# EAGLE design PR9023 (EAGLE 7.5.0)
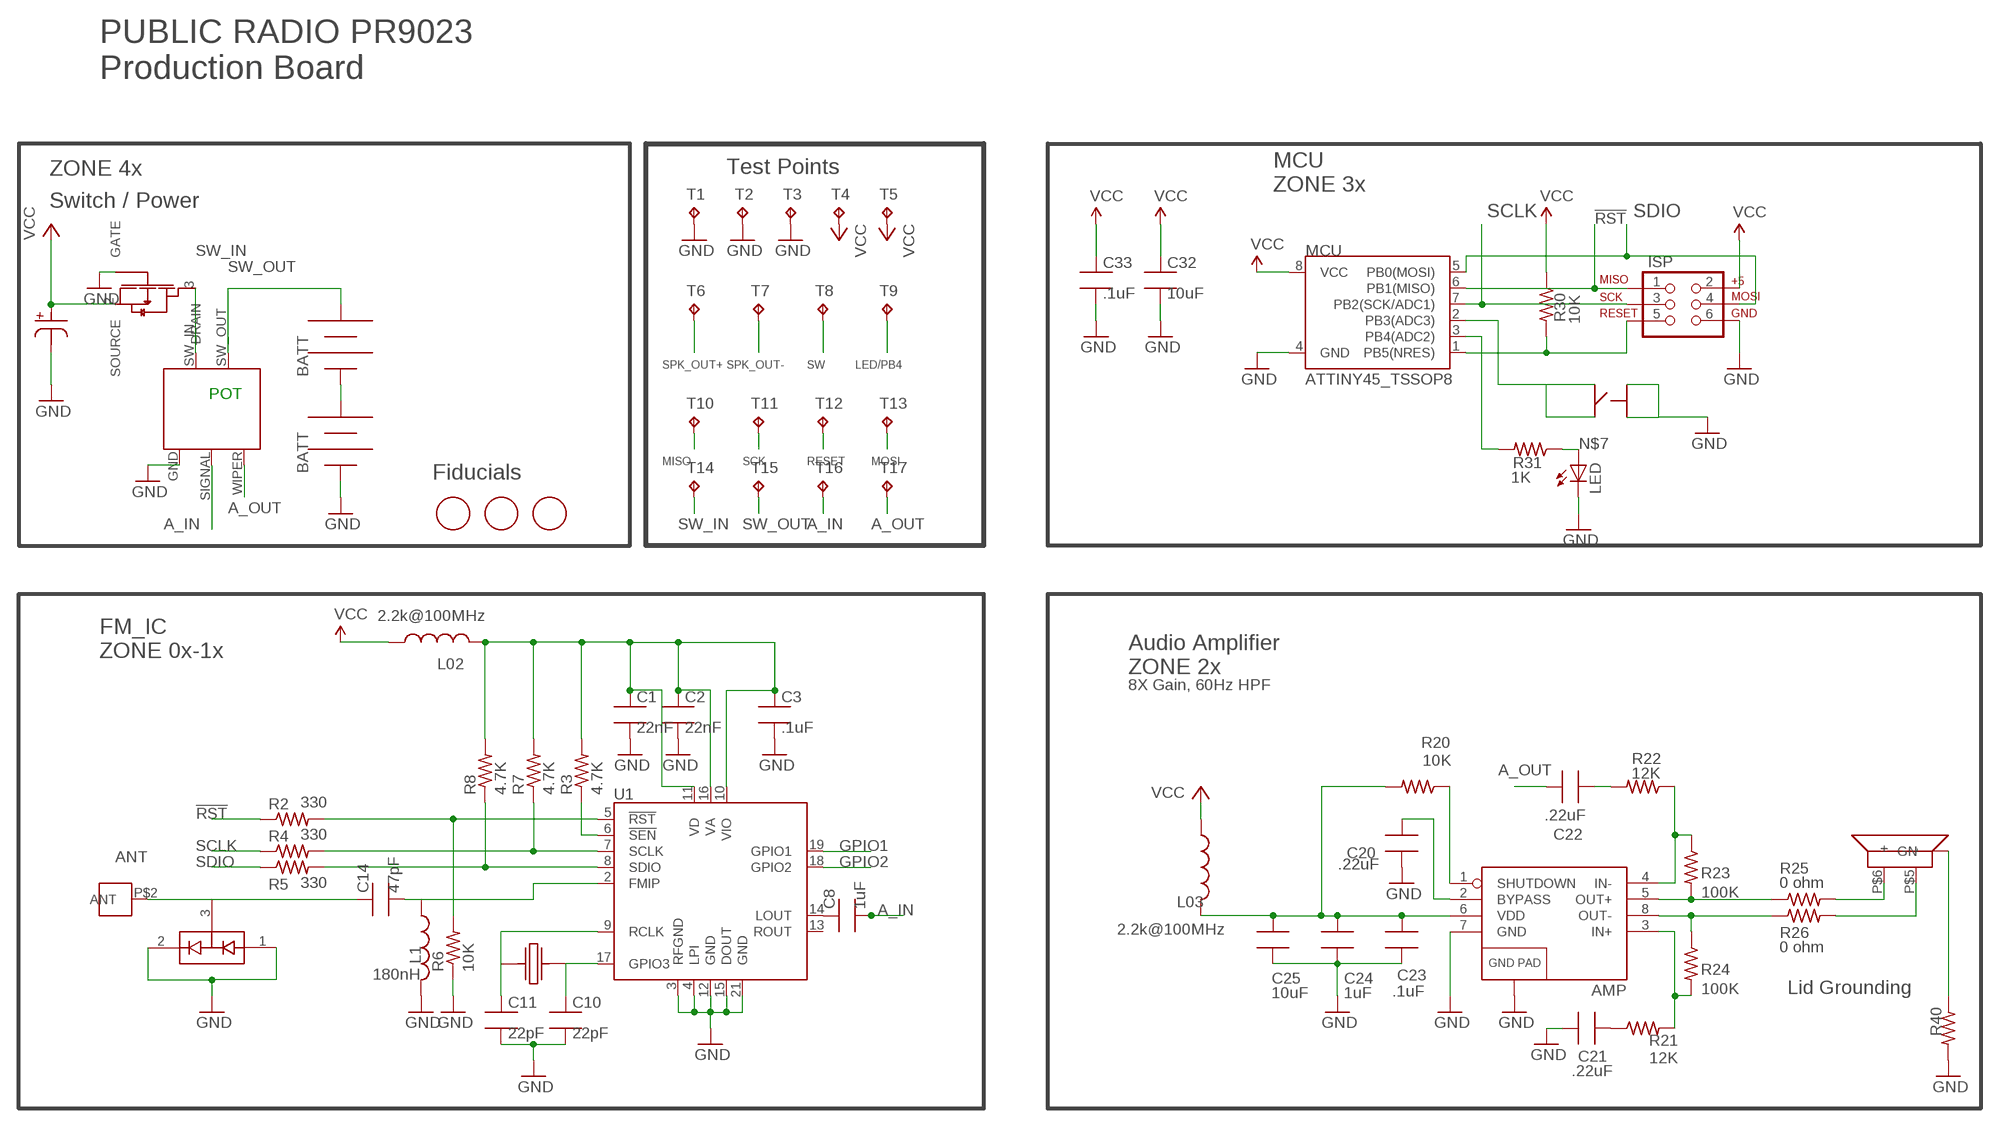
[diagram p0: schematic, sheet 1]

## Parts
AMP  TPA6203A1  [8-MSOP]
ANT_MOUNT  DNP  M3_PEMNUT  [PEM_M3]
C1  22nF  C_SMT_0603_CPL  [0603_CPL]
C2  22nF  C_SMT_0603_CPL  [0603_CPL]
C3  .1uF  C_SMT_0603_CPL  [0603_CPL]
C8  1uF  C_SMT_0603_CPL  [0603_CPL]
C10  22pF  C_SMT_0603_CPL  [0603_CPL]
C11  22pF  C_SMT_0603_CPL  [0603_CPL]
C14  47pF  C_SMT_0603_CPL  [0603_CPL]
C20  .22uF  C_SMT_0603_CPL  [0603_CPL]
C21  .22uF  C_SMT_0603_CPL  [0603_CPL]
C22  .22uF  C_SMT_0603_CPL  [0603_CPL]
C23  .1uF  C_SMT_0603_CPL  [0603_CPL]
C24  1uF  C_SMT_0603_CPL  [0603_CPL]
C25  10uF  C_SMT_0603_CPL  [0603_CPL]
C32  10uF  C_SMT_0603_CPL  [0603_CPL]
C33  .1uF  C_SMT_0603_CPL  [0603_CPL]
C40  220uF  NICHICON_SERIESUD  [NICHICON_UD_63]
D1  BAV99  [SOT23_CPL]
FET1  AO3435  [SOT23_CPL]
ISP  AVR_SPI_PRG_6NS  [2X3-NS]
JP5  BK-92_MPD_AA_BATT_CLIP  [BK92_AA_BATT]
JP6  BK-92_MPD_AA_BATT_CLIP  [BK92_AA_BATT]
L1  180nH  L_SMT_0805_ADAFRUIT  [0805_ADAFRUIT]
L02  2.2k@100MHz  L_SMT_0603_CPL  [0603_CPL]
L03  2.2k@100MHz  L_SMT_0603_CPL  [0603_CPL]
LED  LEDCHIPLED_0805  [CHIPLED_0805]
MARK1  FIDUCIAL  [FIDUCIAL_1MM]
MARK2  FIDUCIAL  [FIDUCIAL_1MM]
MARK3  FIDUCIAL  [FIDUCIAL_1MM]
MCU  ATTINY45_TSSOP8  [TSSOP-8]
R1  RV170SF_TAIWANA_POT_SW  [RV170SF_SW_POT]
R2  330  R_SMT_R0603_CPL  [0603_CPL]
R3  4.7K  R_SMT_R0603_CPL  [0603_CPL]
R4  330  R_SMT_R0603_CPL  [0603_CPL]
R5  330  R_SMT_R0603_CPL  [0603_CPL]
R6  10K  R_SMT_R0603_CPL  [0603_CPL]
R7  4.7K  R_SMT_R0603_CPL  [0603_CPL]
R8  4.7K  R_SMT_R0603_CPL  [0603_CPL]
R20  10K  R_SMT_R0603_CPL  [0603_CPL]
R21  12K  R_SMT_R0603_CPL  [0603_CPL]
R22  12K  R_SMT_R0603_CPL  [0603_CPL]
R23  100K  R_SMT_R0603_CPL  [0603_CPL]
R24  100K  R_SMT_R0603_CPL  [0603_CPL]
R25  0 ohm  R_SMT_0805_ADAFRUIT  [0805_ADAFRUIT]
R26  0 ohm  R_SMT_0805_ADAFRUIT  [0805_ADAFRUIT]
R30  10K  R_SMT_R0603_CPL  [0603_CPL]
R31  1K  R_SMT_R0603_CPL  [0603_CPL]
R40  DNP  R_SMT_R0603_CPL  [0603_CPL]
SPKR_PLACE  DNP  PR9024_SPKR  [PR2024_SPKR_PLACE]
SW1  ESWT_TL3315  [E_SWITCH_TL3315]
T1  TPTP20R  [TP20R]
T2  TPTP20R  [TP20R]
T3  TPTP20R  [TP20R]
T4  TPTP20R  [TP20R]
T5  TPTP20R  [TP20R]
T6  TPTP20R  [TP20R]
T7  TPTP20R  [TP20R]
T8  TPTP20R  [TP20R]
T9  TPTP20R  [TP20R]
T10  TPTP20R  [TP20R]
T11  TPTP20R  [TP20R]
T12  TPTP20R  [TP20R]
T13  TPTP20R  [TP20R]
T14  TPTP20R  [TP20R]
T15  TPTP20R  [TP20R]
T16  TPTP20R  [TP20R]
T17  TPTP20R  [TP20R]
U1  SI4702-C19-GMR  [SI470X_20_QFN]
X1  ABS25XTAL  [4-SOJ]

## Nets
3.3V: C1.1 C2.1 C3.1 L02.2 R3.2 R7.2 R8.2 U1.10(VIO) U1.11(VD) U1.16(VA)
!RST: ISP.1 MCU.6(PB1(MISO)) R2.1 T10.TP
!RST-L: R2.2 R6.2 U1.5(!RST)
!SEN-L: R3.1 U1.6(!SEN)
A_IN: C8.2 R1.SIGNAL T16.TP
A_OUT: C22.2 R1.WIPER T17.TP
ANT [antenna]: ANT_MOUNT.P$2(ANT) C14.1 D1.3(COM)
GND: AMP.7(GND) AMP.9(GND) C1.2 C2.2 C3.2 C10.2 C11.2 C20.1 C21.1 C23.2 C24.2 C25.2 C32.2 C33.2 C40.P$2 D1.1(A1) D1.2(C2) FET1.1(GATE) ISP.6 JP6.NEG JP6.NEG@2(NEG) L1.2 LED.C MCU.4(GND) R1.GND R6.1 R40.2 SW1.P$1 SW1.P$2 T1.TP T2.TP T3.TP U1.3(RFGND) U1.4(LPI) U1.12(GND) U1.15(DOUT) U1.21(GND)
GPIO1: U1.19(GPIO1)
GPIO2: U1.18(GPIO2)
LED/PB4: MCU.3(PB4(ADC2)) R31.2 T9.TP
N$1: C11.1 U1.9(RCLK) X1.P$1
N$2: AMP.6(VDD) C23.1 C24.1 C25.1 L03.2 R20.2
N$3: C22.1 R22.2
N$4: AMP.5(OUT+) R23.2 R25.1
N$5: AMP.3(IN+) R21.2 R24.2
N$6: R40.1 SPKR_PLACE.P$4(GN)
N$7: LED.A R31.1
N$9: C8.1 U1.14(LOUT)
N$10: C10.1 U1.17(GPIO3) X1.P$4
N$11: AMP.8(OUT-) R24.1 R26.1
N$12: AMP.2(BYPASS) C20.2
N$13: JP5.NEG JP5.NEG@2(NEG) JP6.POS JP6.POS@2(POS)
N$14: AMP.4(IN-) R22.1 R23.1
N$16 [antenna]: C14.2 L1.1 U1.2(FMIP)
N$20: AMP.1(SHUTDOWN) R20.1
N$23: C21.2 R21.1
RESET: ISP.5 MCU.1(PB5(NRES)) R30.2 T12.TP
SCLK: ISP.3 MCU.7(PB2(SCK/ADC1)) R4.1 T11.TP
SCLK-L: R4.2 R7.1 U1.7(SCLK)
SDIO: ISP.4 MCU.5(PB0(MOSI)) R5.1 T13.TP
SDIO-L: R5.2 R8.1 U1.8(SDIO)
SPK_OUT+: R25.2 SPKR_PLACE.P$6(+) T6.TP
SPK_OUT-: R26.2 SPKR_PLACE.P$5(-) T7.TP
SW: MCU.2(PB3(ADC3)) SW1.P$3 SW1.P$4 T8.TP
SW_IN: FET1.3(DRAIN) R1.SW_IN T14.TP
SW_OUT: JP5.POS JP5.POS@2(POS) R1.SW_OUT T15.TP
VCC: C32.1 C33.1 C40.P$1 FET1.2(SOURCE) ISP.2 L02.1 L03.1 MCU.8(VCC) R30.1 T4.TP T5.TP
Unconnected: U1.13(ROUT)

## Notes on the sheet
- PUBLIC RADIO PR9023
  Production Board
- ZONE 4x | Test Points
- MCU
  ZONE 3x
- Switch / Power
- POT
- MISO | SCK | RESET | MOSI
- Fiducials
- FM_IC
  ZONE 0x-1x
- Audio Amplifier 
  ZONE 2x
- 8X Gain, 60Hz HPF
- Lid Grounding

## Library data of the parts
AMP = PR_Parts_Library:TPA6203A1: IC AMP AUDIO PWR 1.25W AB 8MSOP; MFG_PN: TPA6203A1DGNR
ANT_MOUNT = PR_Parts_Library:M3_PEMNUT
C1 C2 = PR_Parts_Library:C_SMT: SMT capacitor; MFG_PN: CL10B223KB8NNNC; TOL: 10%; VOLTAGE: 16V
C3 C23 C33 = PR_Parts_Library:C_SMT: SMT capacitor; MFG_PN: CL10B104KB8SFNC; TOL: 10%; VOLTAGE: 16V
C8 C24 = PR_Parts_Library:C_SMT: SMT capacitor; MFG_PN: CL10B105KP8NNNC; TOL: 10%; VOLTAGE: 10V
C10 C11 = PR_Parts_Library:C_SMT: SMT capacitor; MFG_PN: C1608C0G1H220J080AA; TOL: 5%; VOLTAGE: 50V
C14 = PR_Parts_Library:C_SMT: SMT capacitor; MFG_PN: CL10C470JB8NCNC; TOL: 5%; VOLTAGE: 50V
C20-C22 = PR_Parts_Library:C_SMT: SMT capacitor; MFG_PN: C1608X7R1C224K080AC; TOL: 10%; VOLTAGE: 16V
C25 C32 = PR_Parts_Library:C_SMT: SMT capacitor; MFG_PN: CL10A106MQ8NNNC; TOL: 20%; VOLTAGE: 6.3V
C40 = PR_Parts_Library:NICHICON_SERIESUD: Nichicon UD Series 220uf Cap MFG# UUD1C221MCL1GS; MFG_PN: UUD1C221MCL1GS; TOL: 20%; VOLTAGE: 16V
D1 = PR_Parts_Library:BAV99: DIODE ARRAY GP 100V 215MA SOT23; MFG_PN: BAV99,215
FET1 = PR_Parts_Library:AO3435: MOSFET P-CH 20V 2.9A SOT23; MFG_PN: AO3435
ISP = PR_Parts_Library:AVR_SPI_PRG_6: DIL VERTICAL PC TAIL PIN HEADER; MFG_PN: M20-9980346
JP5 JP6 = PR_Parts_Library:BK-92_MPD_AA_BATT_CLIP: Thru hole AA battery clip pair.; MFG_PN: 2 of BK92 - supplied by CL Labs
L1 = PR_Parts_Library:L_SMT: SMT inductor; CURRENT: 400mA; DCR: 640m; MFG_PN: AISC-0805-R18J-T; TOL: 5%
L02 L03 = PR_Parts_Library:L_SMT: SMT inductor; CURRENT: 150mA; DCR: 2.3; MFG_PN: HZ0603A222R-10
LED = adafruit:LED: LED OSRAM: - CHIPLED LG R971, LG N971, LY N971, LG Q971, LY Q971, LO R971, LY R971 LH N974, LH R974 LS Q976, LO Q976, LY Q976 LO Q996 - Hyper CHIPLED LW Q18S LB Q993, LB Q99A, LB R99A - SideLED LS A670, LO A670, LY A670, LG A670, LP A670 LB A673, LV A673, LT A673, LW A673 LH A674 LY A675 LS A676, LA A676, LO A676, LY A676, LW A676 LS A679, LY A679, LG A679 - Hyper Micro SIDELED® LS Y876, LA Y876, LO Y876, LY Y876 LT Y87S - SmartLED LW L88C, LW L88S LB L89C, LB L89S, LG L890 LS L89K, LO L89K, LY L89K LS L896, LA L896, LO L896, LY L896 - TOPLED LS T670, LO T670, LY T670, LG T670, LP T670 LSG T670, LSP T670, LSY T670, LOP T670, LYG T670 LG T671, LOG T671, LSG T671 LB T673, LV T673, LT T673, LW T673 LH T674 LS T676, LA T676, LO T676, LY T676, LB T676, LH T676, LSB T676, LW T676 LB T67C, LV T67C, LT T67C, LS T67K, LO T67K, LY T67K, LW E67C LS E67B, LA E67B, LO E67B, LY E67B, LB E67C, LV E67C, LT E67C LW T67C LS T679, LY T679, LG T679 LS T770, LO T770, LY T770, LG T770, LP T770 LB T773, LV T773, LT T773, LW T773 LH T774 LS E675, LA E675, LY E675, LS T675 LS T776, LA T776, LO T776, LY T776, LB T776 LHGB T686 LT T68C, LB T68C - Hyper Mini TOPLED® LB M676 - Mini TOPLED Santana® LG M470 LS M47K, LO M47K, LY M47K Source: http://www.osram.convergy.de/; MFG_PN: LY R976-PS-36
MARK1-MARK3 = PR_Parts_Library:FIDUCIAL: 1mm fiducial.; MFG_PN: DNP
MCU = PR_Parts_Library:ATTINY45_TSSOP8
R1 = PR_Parts_Library:RV170SF_TAIWANA_POT_SW: Thru hole switched potentiometer.; MFG_PN: RV170SF-43-20F-A10K - supplied by CL Labs
R2 R4 R5 = PR_Parts_Library:R_SMT: SMT resistor; MFG_PN: MCR03ERTJ331; POWER: 1/10W; TOL: 5%
R3 R7 R8 = PR_Parts_Library:R_SMT: SMT resistor; MFG_PN: ERJ-3EKF4701V; POWER: 1/10W; TOL: 1%
R6 R20 R30 = PR_Parts_Library:R_SMT: SMT resistor; MFG_PN: ERJ-3GEYJ103V; POWER: 1/10W; TOL: 5%
R21 R22 = PR_Parts_Library:R_SMT: SMT resistor; MFG_PN: RC0603FR-0712KL; POWER: 1/10W; TOL: 1%
R23 R24 = PR_Parts_Library:R_SMT: SMT resistor; MFG_PN: ERJ-3EKF1003V; POWER: 1/10W; TOL: 1%
R25 R26 = PR_Parts_Library:R_SMT: SMT resistor; MFG_PN: ERJ-6GEY0R00V
R31 = PR_Parts_Library:R_SMT: SMT resistor; MFG_PN: ERJ-3EKF1001V; POWER: 1/10W; TOL: 1%
R40 = PR_Parts_Library:R_SMT: SMT resistor; MFG_PN: ERJ-3GEY0R00V
SPKR_PLACE = PR_Parts_Library:PR9024_SPKR
SW1 = PR_Parts_Library:ESWT_TL3315; MFG_PN: TL3315NF100Q
T1-T17 = PR_Parts_Library:TP: Test pad; MFG_PN: DNP
U1 = PR_Parts_Library:SI4702-C19-GMR: IC FM RADIO TUNER 20-QFN; MFG_PN: Si4702 C19 GM - supplied by CL Labs
X1 = PR_Parts_Library:ABS25XTAL: 4PIN 32.768 Xtal MFG# ABS25-32.768KHZ-T; MFG_PN: ABS25-32.768KHZ-T

## Net classes
1 antenna: clearance 1.27 mm

## Board
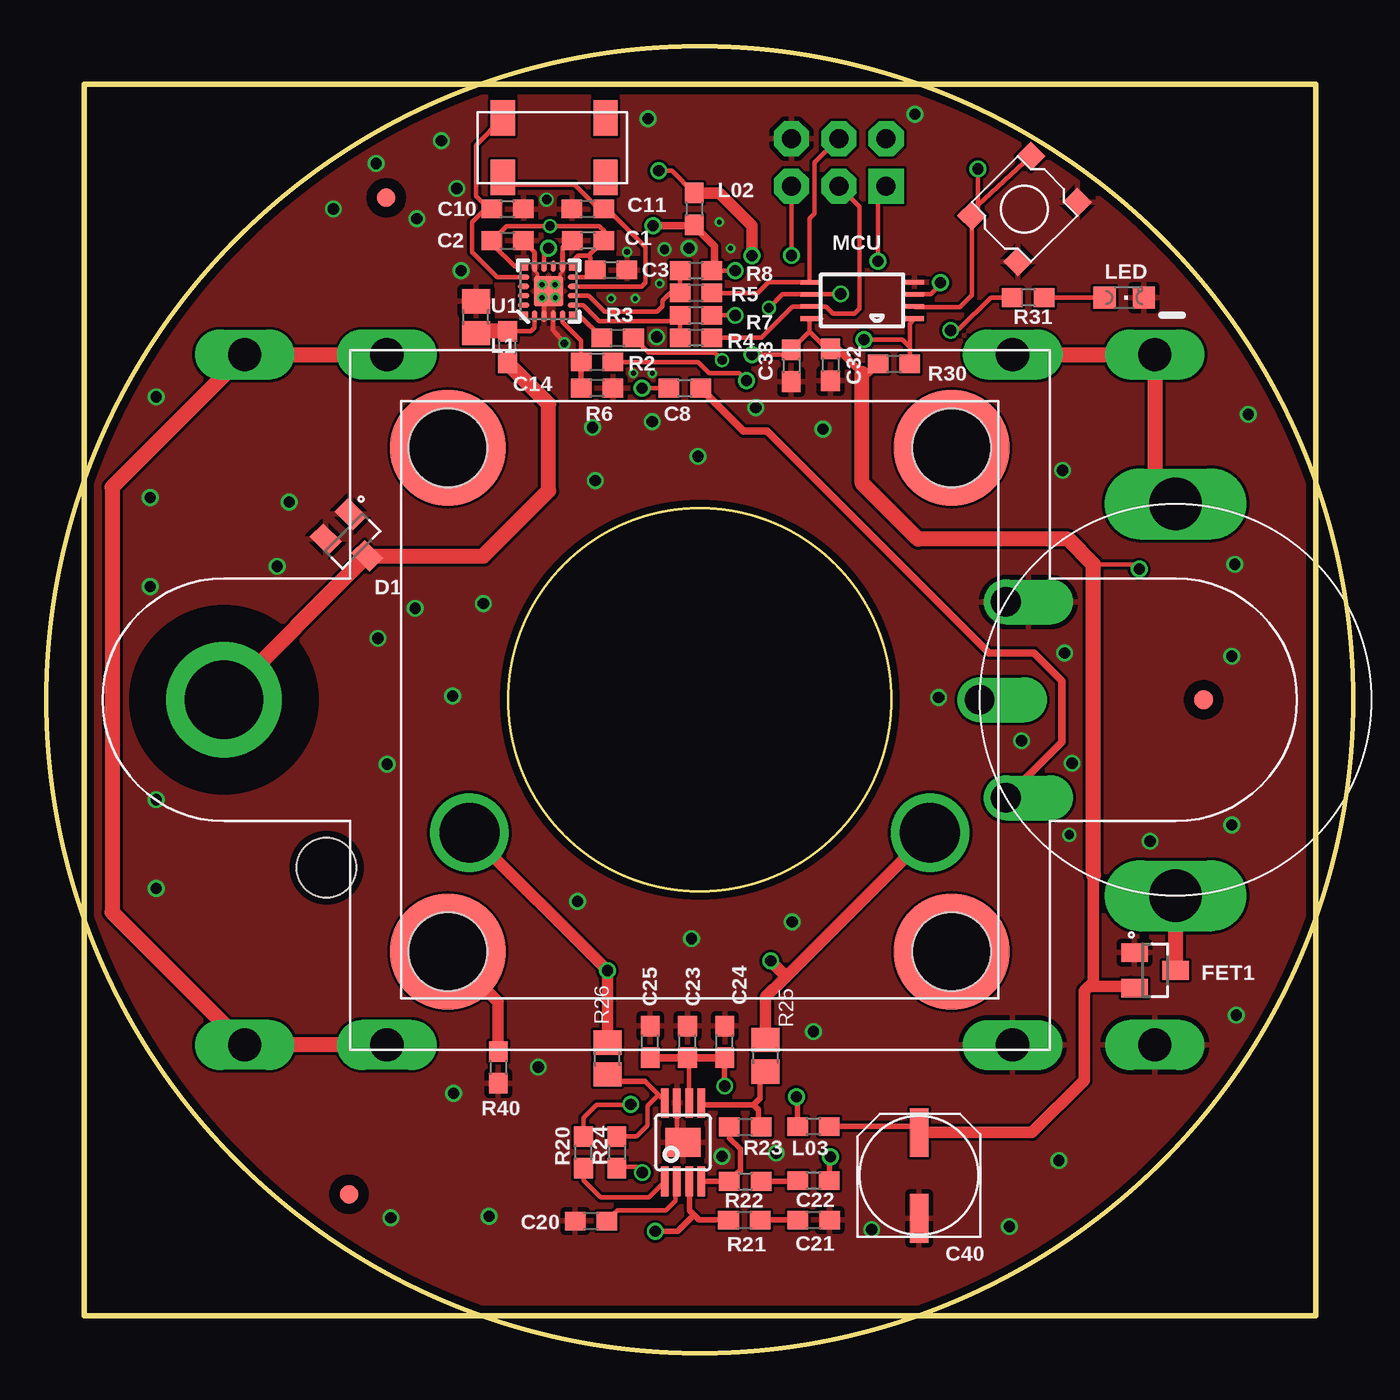
[diagram p1: board, top side]
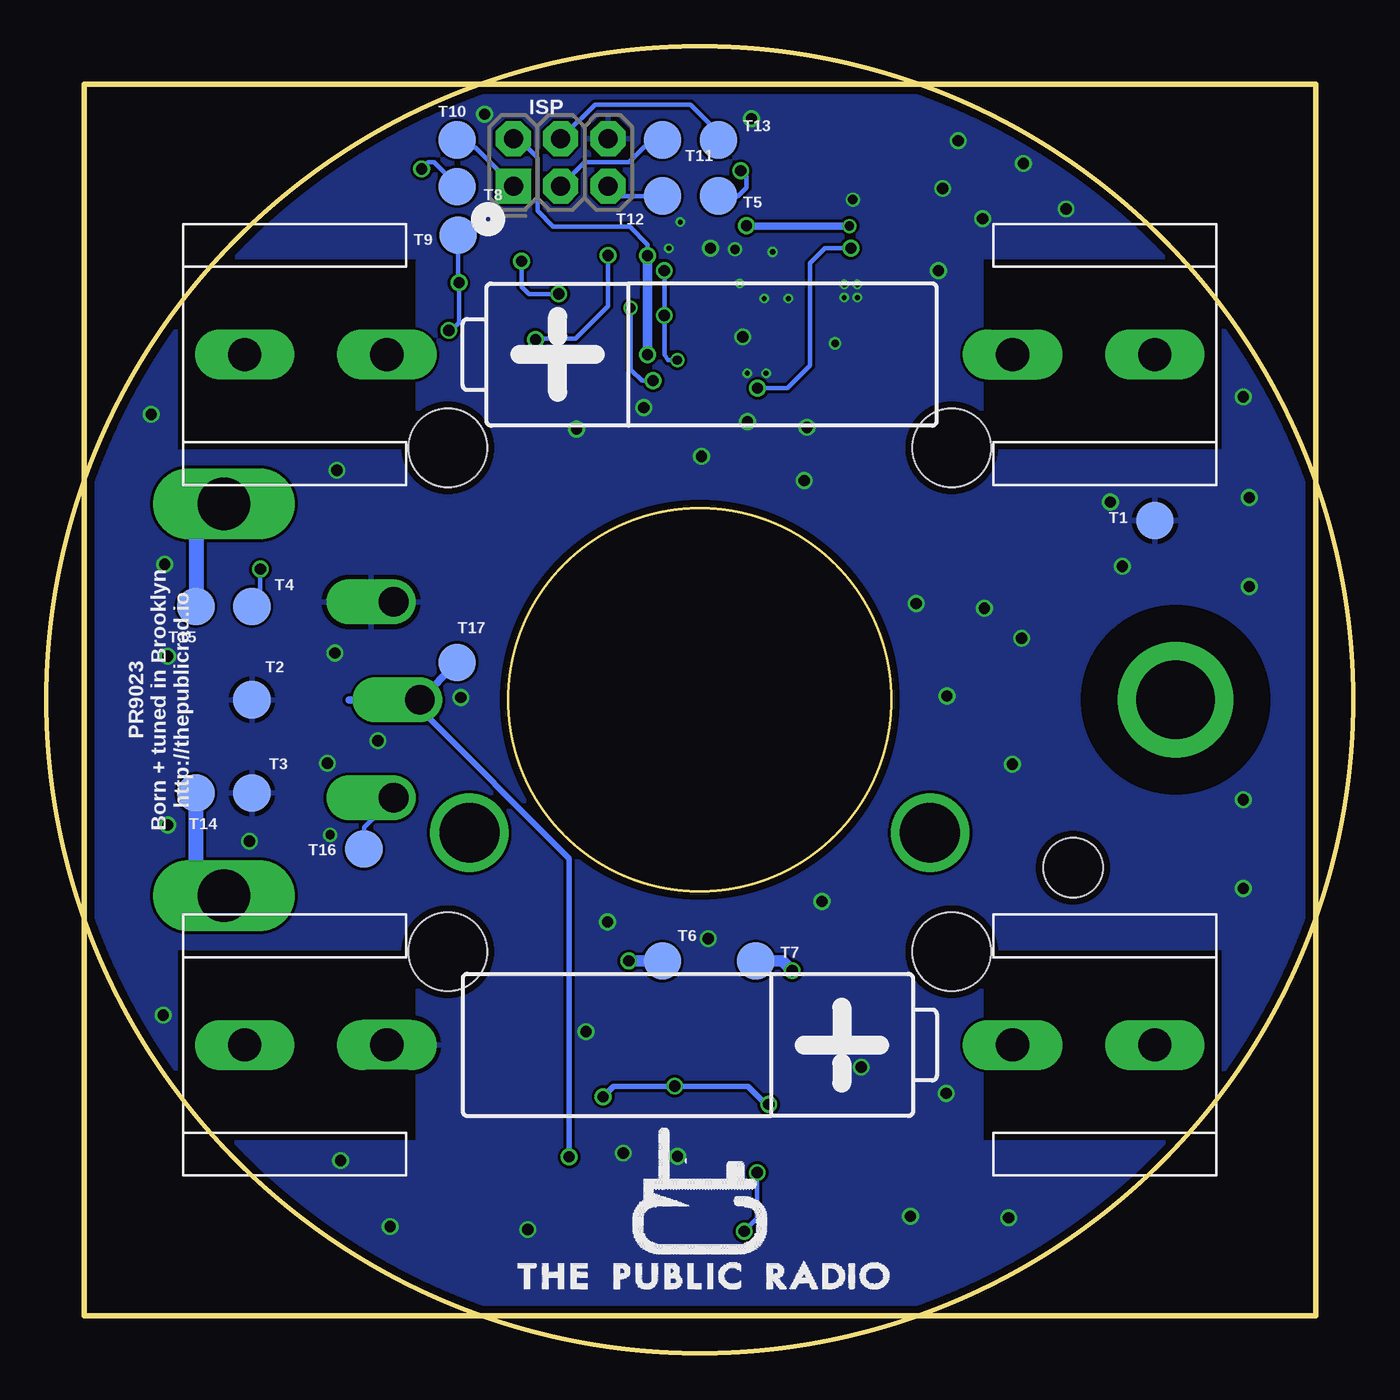
[diagram p2: board, bottom side, seen from below]

Size 70 x 70 mm. Coordinates in mm from the lower left corner, seen from the top.
Outline: 2,68 68,68 68,2 2,2 2,68
Outline: circle at 35,35 radius 35
Copper layers (1*16): Top 0.0356mm / dielectric 1.5011mm / Bottom 0.0356mm
Design rules "LaenPCBOrder *": minimum track width 6mil, minimum drill 13mil, track to track 6mil, track to pad 6mil, pad to pad 6mil, via to via 6mil, smd to smd 6mil, copper to edge 15mil, drill to drill 6mil, minimum pad ring 7mil, minimum via ring 5mil, stop-mask expansion 3mil, vias tented up to drill 0mil, thermal gap 10mil
Holes 3.2 mm at 15,26
tRestrict: area 26.1,56.1 to 27.7,57.7; 8 lines

### Footprints (pad centres in the part's own frame; a part is rotated, then mirrored left to right if it is on the bottom)
8-MSOP = smd 0.4 x 1.6: 1 -0.975,-2.1; 2 -0.325,-2.1; 3 0.325,-2.1; 4 0.975,-2.1; 5 0.975,2.1; 6 0.325,2.1; 7 -0.325,2.1; 8 -0.975,2.1 | smd 1.89 x 1.57: 9 0,0
PEM_M3 = drill 4.22 pad 6.2: P$2 0,0
0603_CPL = smd 1.1 x 1: 1 -0.85,0; 2 0.85,0
NICHICON_UD_63 = smd 1 x 2.6: P$1 0,2.3; P$2 0,-2.3
SOT23_CPL = smd 1.4 x 1: 1 -1.1,0.95; 2 -1.1,-0.95; 3 1.1,0
2X3-NS = drill 1.016 pad 1.88 square: 1 -2.54,-1.27 | drill 1.016 pad 1.88 octagon: 2 -2.54,1.27; 3 0,-1.27; 4 0,1.27; 5 2.54,-1.27; 6 2.54,1.27
BK92_AA_BATT = drill 1.778 long: NEG -24.384,0; NEG@2 -16.764,0; POS 16.764,0; POS@2 24.384,0
0805_ADAFRUIT = smd 1.3 x 1.5: 1 -0.85,0; 2 0.85,0
CHIPLED_0805 = smd 1.2 x 1.2: A 0,-1.05; C 0,1.05
FIDUCIAL_1MM = smd 1 x 1: 1 0,0
TSSOP-8 = smd 0.25 x 1: 1 -0.975,-2.813; 2 -0.325,-2.813; 3 0.325,-2.813; 4 0.975,-2.813; 5 0.975,2.813; 6 0.325,2.813; 7 -0.325,2.813; 8 -0.975,2.813
RV170SF_SW_POT = drill 1.6 offset: GND -5.25,-9.09; SIGNAL 5.25,-9.09; WIPER 0,-10.5 | drill 2.8 long: SW_IN 10.5,0; SW_OUT -10.5,0
PR2024_SPKR_PLACE(SMD) = smd 6.2 x 6.2: P$1 -13.5,13.5; P$2 13.5,13.5; P$3 13.5,-13.5; P$4 -13.5,-13.5 | drill 3.2: P$5 -12.341,-7.125; P$6 12.341,-7.125 | hole 4.22: -13.5,-13.5; -13.5,13.5; 13.5,-13.5; 13.5,13.5
E_SWITCH_TL3315 = smd 1.1 x 1.1: P$1 -2.25,1.75; P$2 2.25,1.75; P$3 -2.25,-1.75; P$4 2.25,-1.75
TP20R = smd 2 x 2: TP 0,0
SI470X_20_QFN = smd 0.34 x 0.34: 1 -1.275,1.265; 6 -1.265,-1.265; 11 1.265,-1.265; 16 1.265,1.265 | smd 0.61 x 0.28: 2 -1.335,0.75; 3 -1.335,0.25; 4 -1.335,-0.25; 5 -1.335,-0.75; 12 1.335,-0.75; 13 1.335,-0.25; 14 1.335,0.25; 15 1.335,0.75 | smd 0.28 x 0.61: 7 -0.75,-1.335; 8 -0.25,-1.335; 9 0.25,-1.335; 10 0.75,-1.335; 17 0.75,1.335; 18 0.25,1.335; 19 -0.25,1.335; 20 -0.75,1.335 | smd 1.6 x 1.6: 21 0,0
4-SOJ = smd 1.3 x 1.9: P$1 -2.75,-1.6; P$2 2.75,-1.6; P$3 2.75,1.6; P$4 -2.75,1.6

### Placement (x,y rotation side)
AMP  34.1,11.29 0 top
ANT_MOUNT  9.5,35 0 top
C1  29.01,59.6 180 top
C2  24.7,59.6 0 top
C3  30.24,58.03 0 top
C8  34.2,51.7 0 top
C10  24.7,61.3 0 top
C11  29,61.3 180 top
C14  24.7,53.9 90 top
C20  29.18,7.06 0 top
C21  41.11,7.12 180 top
C22  41.09,9.23 0 top
C23  34.34,16.66 90 top
C24  36.34,16.66 90 top
C25  32.34,16.66 90 top
C32  42,52.95 270 top
C33  39.9,52.9 270 top
C40  46.75,9.51 0 top
D1  16.4,43.5 315 top
FET1  59.4,20.5 0 top
ISP  42.45,63.8 0 bottom
JP5  35,53.5 180 bottom
JP6  35,16.5 0 bottom
L1  23,55.5 90 top
L02  34.7,61.3 270 top
L03  41.09,12.13 180 top
LED  57.75,56.55 270 top
MARK1  16.2,8.5 0 top
MARK2  18.2,61.9 0 top
MARK3  62,35 0 top
MCU  43.7,56.4 90 top
R1  60.5,35 270 top
R2  29.5,53.1 180 top
R3  30.6,54.4 0 top
R4  34.8,54.4 180 top
R5  34.8,56.8 180 top
R6  29.5,51.7 180 top
R7  34.8,55.6 0 top
R8  34.8,58 0 top
R20  28.77,10.74 90 top
R21  37.39,7.12 180 top
R22  37.44,9.19 0 top
R23  37.44,12.11 0 top
R24  30.56,10.74 270 top
R25  38.53,15.92 90 top
R26  30.05,15.78 90 top
R30  45.4,53 0 top
R31  52.6,56.55 180 top
R40  24.2,15.3 270 top
SPKR_PLACE  DNP  [PR2024_SPKR_PLACE(SMD)]  35,35 0 top
SW1  52.4,61.3 225 top
T1  10.6,44.6 0 bottom
T2  59,35 0 bottom
T3  59,30 0 bottom
T4  59,40 0 bottom
T5  34,62 0 bottom
T6  37,21 0 bottom
T7  32,21 0 bottom
T8  48,62.5 0 bottom
T9  47.95,59.9 0 bottom
T10  48,65 0 bottom
T11  37,65 0 bottom
T12  37,62 0 bottom
T13  34,65 0 bottom
T14  62,30 0 bottom
T15  62,40 0 bottom
T16  53,27 0 bottom
T17  48,37 0 bottom
U1  26.9,56.9 90 top
U$1  [PR_LOGO]  35,9 0 bottom
X1  27.2,64.58 0 top

### Tracks (layer width: path | path; a pad name or v marks a point on that pad's centre or on a via)
3.3V  (via drill 0.5, 0.6)
  Top 0.254: R7.2 v36.9,55.6 | 25.23,58.16 U1.16 25.6,58.2 25.1,58.2 23.85,59.45 C2.1 24.64,60.39 v26.98,60.39 29.61,60.39 29.9,60.1 29.9,59.64 C1.1 | v36.2,53.2 35.8,53.6 32.25,53.6 R3.2 | U1.10 28.35,57.65 | R8.2 v36.9,58 | U1.11 28.16,58.48 28.47,58.79 29.05,58.79 | 29.05,58.79 C1.1 | 29.8,59.66 C1.1 | U1.10 29.07,57.65 C3.1 | U1.10 28.93,57.65 29.16,57.88 29.16,58.68 29.05,58.79
  Top 0.406: 34.7,60.4 35.8,59.3 35.8,58.05 | v32.5,60.4 34.65,60.4 L02.2
  Top 0.61: L02.2 34.7,60.4 | 35.8,58.05 R8.2
  Bottom 0.254: v36.9,58 v36.9,55.6 36.9,53.5 36.7,53.2 v36.2,53.2
  Bottom 0.406: v26.98,60.39 32.29,60.39 v32.5,60.4
!RST  (via drill 0.5, 0.6)
  Top 0.254: R2.1 34.9,53.1 35.5,52.5 37.1,52.5 v37.5,52.1 | v38.7,56 39.42,56.73 MCU.6 42.52,56.73 v42.55,56.75 | v44.55,58.5 44.55,62.09 ISP.1
  Bottom 0.254: v38.7,56 38.7,52.7 38.1,52.1 v37.5,52.1 | v42.55,56.75 44.15,56.75 44.55,57.15 v44.55,58.5 | ISP.1 47.05,64.6 47.6,64.6 T10.TP
!RST-L
  Top 0.254: U1.5 27.65,55.25 28.65,54.25 R2.2
  Top 0.305: R6.2 R2.2
!SEN-L
  Top 0.254: R3.1 28.52,55.63 U1.6
A_IN
  Top 0.406: R1.SIGNAL 54.4,32.74 54.4,36 52.9,37.5 50.5,37.5 38.6,49.4 37.35,49.4 C8.2
  Bottom 0.254: T16.TP 53,28.16 R1.SIGNAL
A_OUT  (via drill 0.6)
  Top 0.305: C22.2 41.94,10.44 v42,10.5
  Bottom 0.305: v42,10.5 42,26.5 50,34.5 R1.WIPER
  Bottom 0.406: 53.8,35 R1.WIPER T17.TP
ANT
  Top 0.406: 24.85,53.05 C14.1
  Top 0.813: ANT_MOUNT.P$2 9.5,35.04 D1.3 17.2,42.7 23.4,42.7 26.9,46.2 26.9,50.85 C14.1
GND  (via drill 0.25, 0.25 pad 0.1, 0.3, 0.4, 0.5, 0.6)
  Top 0.2: U1.12 27.65,57.95 27.5,57.8 27.5,57.5 v27.25,57.25 | 26.34,57.46 v26.55,57.25 26.31,57.49 26.31,57.84 26.15,58 U1.15 | 27.15,56.44 v27.26,56.55
  Top 0.254: v27.25,57.25 U1.21 | v26.55,57.25 v26.55,57.24 26.57,57.23 | U1.15 26.15,59 C2.2 | U1.12 27.65,59.25 28,59.6 C1.2 | U1.4 27.15,54.8 v27.75,54.1 | U1.3 26.65,56.45 v26.55,56.55 | AMP.7 33.77,11.61 AMP.9
  Top 0.305: 33.77,11.13 AMP.9
  Top 0.406: 33.77,11.13 33.77,10.73 33.8,10.71
  other vias: 32.45,49.9 64.4,50.3 29.4,46.75 18.45,7.24 21.8,13.9 39.95,23.1 52.25,32.8 21.15,64.95 26.35,15.31 41.6,49.5 21.98,62.4 19.84,60.78 15.37,61.31 54.25,10.3 63.75,18.1 29.25,49.6 19.75,39.9 23.4,40.15 21.75,35.2 34.9,48.05 17.65,63.74 18.25,31.55 22.21,58 38,50.65 17.75,38.3 12.35,42.15 12.99,45.59 32.22,66.14 26.8,61.81 31.1,59 34.42,59.2 32.7,54.45 41.1,17.21 47.8,35.12 54.55,37.5 54.95,31.6 54.45,47.3 30.25,56.5 31.55,56.5 32.85,57.3 36.65,59.2 36.05,60.6 32.45,52.5 31.45,52.5 33.11,59.14 54.81,27.76 59.13,27.42 44.22,6.61 34.55,22.2 28.45,24.2 5.87,24.88 5.87,29.64 5.55,41.08 5.55,45.84 5.87,51.23 23.71,7.33 63.67,42.26 63.52,28.29 63.52,37.33 46.53,66.39 51.59,6.77 36.2,10.53 39.1,10.71
  pour Bottom: 2,68 68,68 68,2 2,2
  pour Top: 2,68 68,68 68,2 2,2
LED/PB4  (via drill 0.6)
  Top 0.254: R31.2 50.6,56.55 48.9,54.85 48.5,54.85 v48.45,54.8 | 47.9,57.65 v47.9,57.35 47.9,57.25 47.4,56.75 46.54,56.75 MCU.3
  Bottom 0.254: v48.45,54.8 48.3,54.8 47.9,55.2 v47.9,57.35 47.95,57.4 T9.TP
N$1
  Top 0.254: X1.P$1 24.75,62.6 28.3,62.6 29.6,61.3 C11.1 | C11.1 29.7,61.3 | C11.1 30.05,61.3 32.1,59.25 32.1,57.36 31.89,57.15 U1.9
N$2  (via drill 0.6)
  Top 0.254: AMP.6 34.42,15.73 C23.1 | R20.2 28.77,12.61 29.47,13.3 v31.29,13.3 v31.3,13.31
  Top 0.305: C24.1 v36.34,14.29 | L03.2 40.24,13.66 v40.18,13.72
  Top 0.406: C24.1 C23.1 | C23.1 34.27,15.81 | C25.1 C23.1
  Bottom 0.305: v31.3,13.31 31.44,13.31 32.41,14.28 36.33,14.28 v36.34,14.29 39.61,14.29 v40.18,13.72
N$3
  Top 0.305: R22.2 40.2,9.19 C22.1
N$4
  Top 0.254: AMP.5 | 38.36,14.9 R25.1
  Top 0.305: AMP.5 35.16,13.3 37.87,13.3 | 37.87,13.3 38.15,13.02 38.15,12.25 R23.2 | 37.87,13.3 38.22,13.65 38.22,14.76 R25.1
  Top 0.406: R23.2 38.6,11.86
N$5  (via drill 0.6)
  Top 0.254: v31.92,9.66 31.62,9.96 30.63,9.96 R24.2
  Top 0.305: AMP.3 34.4,8.69 34.44,8.64 34.44,7.63 34.69,7.38 | R21.2 34.95,7.12 34.69,7.38 | v32.62,6.51 33.81,6.51 34.69,7.38
  Bottom 0.254: v31.92,9.66 31.92,7.21 v32.62,6.51
N$6
  Top 0.61: SPKR_PLACE.P$4 24.2,18.8 R40.1
N$7
  Top 0.254: R31.1 LED.A
N$9  (via drill 0.6)
  Top 0.254: U1.14 26.65,58.95 v26.9,59.2 | v31.9,51.7 C8.1
  Bottom 0.254: v31.9,51.7 30.3,51.7 29.1,52.9 29.1,58.4 28.3,59.2 v26.9,59.2
N$10
  Top 0.254: U1.17 24.15,57.65 22.8,59 22.8,60.6 23.5,61.3 C10.1 | C10.1 23.8,61.2 | X1.P$4 23,64.73 23,62 23.7,61.3 C10.1
N$11
  Top 0.254: 30.55,14.71 R26.1 | AMP.8 33.12,13.49 32.8,13.82 | 32.8,13.82 32.06,14.56 | R24.1 31.61,11.59 32.2,12.18 32.2,13.23 32.8,13.82
  Top 0.305: 32.06,14.56 30.7,14.56 30.55,14.71
  Top 0.406: 33.12,12.94 AMP.8
N$12
  Top 0.254: AMP.2 33.7,8.63 33.7,8.15 33.18,7.63 30.59,7.63 C20.2
N$13
  Top 0.813: JP6.POS JP6.POS@2 3.5,23.62 3.5,46.38 JP5.NEG JP5.NEG@2
N$14
  Top 0.254: 36.89,8.94 R22.1
  Top 0.305: AMP.4 R22.1 37.17,9.78 37.17,10.92 36.59,11.5 R23.1
N$16
  Top 0.254: C14.2 25.95,54.75 26.15,54.95 U1.2
  Top 0.813: C14.2 23.1,54.75 L1.1
N$20
  Top 0.254: AMP.1 32.27,8.33 29.68,8.33 28.77,9.23 R20.1
N$21
  pour Bottom: 
N$23
  Top 0.305: C21.2 R21.1
RESET  (via drill 0.6)
  Top 0.254: R30.2 46.25,53.9 | 46.25,53.9 46.25,55.16 MCU.1 | ISP.5 v39.91,58.81 v39.9,58.8 | v43.8,54.3 45.85,54.3 46.25,53.9
  Bottom 0.254: ISP.5 39.38,62 T12.TP | v39.91,58.81 39.91,56.09 41.65,54.35 43.75,54.35 v43.8,54.3
SCLK
  Top 0.254: R4.1 38.3,54.4 39.98,56.08 MCU.7 41.77,56.08 42.15,55.7 43.3,55.7 43.55,55.95 43.55,61.43 ISP.3
  Bottom 0.254: T11.TP 37.6,65 38.8,63.8 41.18,63.8 ISP.3
SCLK-L
  Top 0.254: R4.2 R7.1 33.65,55.3 29.6,55.3 28.75,56.15 U1.7
SDIO
  Top 0.254: R5.1 38.1,56.8 38.67,57.38 MCU.5 40.89,60.79 41.15,61.05 41.15,63.77 ISP.4
  Bottom 0.254: T13.TP 34,65.4 35.5,66.9 40.62,66.9 ISP.4
SDIO-L
  Top 0.254: R5.2 R8.1 | 33.85,57 R5.2 | R5.2 33.4,56.8 33,56.4 33,56.1 32.7,55.8 29.9,55.8 29.05,56.65 U1.8
SPK_OUT+  (via drill 0.6)
  Top 0.61: SPKR_PLACE.P$6 39.48,20.02 | 39.48,20.02 38.53,19.06 R25.2 | v38.8,21 39.48,20.32 39.48,20.02
  Bottom 0.61: T6.TP v38.8,21
SPK_OUT-  (via drill 0.6)
  Top 0.61: SPKR_PLACE.P$5 v30.05,20.48 30.05,20 R26.2
  Bottom 0.61: T7.TP 30.57,21 v30.05,20.48
SW  (via drill 0.6)
  Top 0.254: MCU.2 46.54,56.05 48.95,56.05 49.57,56.67 SW1.P$4 49.9,61.27 49.9,61.5 | 49.9,61.5 SW1.P$3 | 49.9,61.5 v49.9,63.45
  Bottom 0.254: T8.TP 48,62.55 49.25,63.8 49.55,63.8 v49.9,63.45
SW_IN
  Top 0.813: FET1.3 R1.SW_IN
  Bottom 0.813: R1.SW_IN 62,26 T14.TP
SW_OUT
  Top 0.813: JP5.POS JP5.POS@2 59.38,46.62 R1.SW_OUT
  Bottom 0.813: R1.SW_OUT 62,44 T15.TP
VCC  (via drill 0.6)
  Top 0.254: v32.8,63.35 33.5,63.35 L02.1 | v58.55,42 58.3,42.25 56.1,42.25 | 39.85,53.49 v37.8,53.49 | C33.1 40.89,54.74 | 40.89,54.74 MCU.8 | 40.89,54.74 41.82,53.8 C32.1
  Top 0.305: C33.1 39.85,53.49 | L03.1 46.43,12.13 C40.P$1
  Top 0.406: C32.1 42.4,53.8 43.7,52.5 44.05,52.5 R30.1
  Top 0.61: L02.1 36.05,62.15 37.8,60.4 v37.8,58.8 | 58.1,19.65 55.85,19.65 | 55.85,19.65 55.6,19.4 55.6,14.6 52.81,11.81 C40.P$1 | 55.85,19.65 56.1,19.9 56.1,25.6
  Top 0.813: 56.1,25.6 56.1,42.25 54.75,43.6 46.7,43.6 43.7,46.6 43.7,52.5 | 58.1,19.65 FET1.2
  Bottom 0.254: ISP.2 44.72,65.07 43.7,64.05 43.7,61.2 42.85,60.35 38.75,60.35 37.8,59.4 v37.8,58.8 | T5.TP 32.95,62 32.5,62.45 32.5,63.05 v32.8,63.35 | T4.TP 58.55,40.45 v58.55,42
  Bottom 0.5: v37.8,53.5 v37.8,58.8
  Bottom 0.61: v37.8,53.49 v37.8,53.5

### Text on the board
bNames: PR9023 / Born + tuned in Brooklyn / http://thepublicrad.io